# EAGLE design LP-LED (EAGLE 6.4)
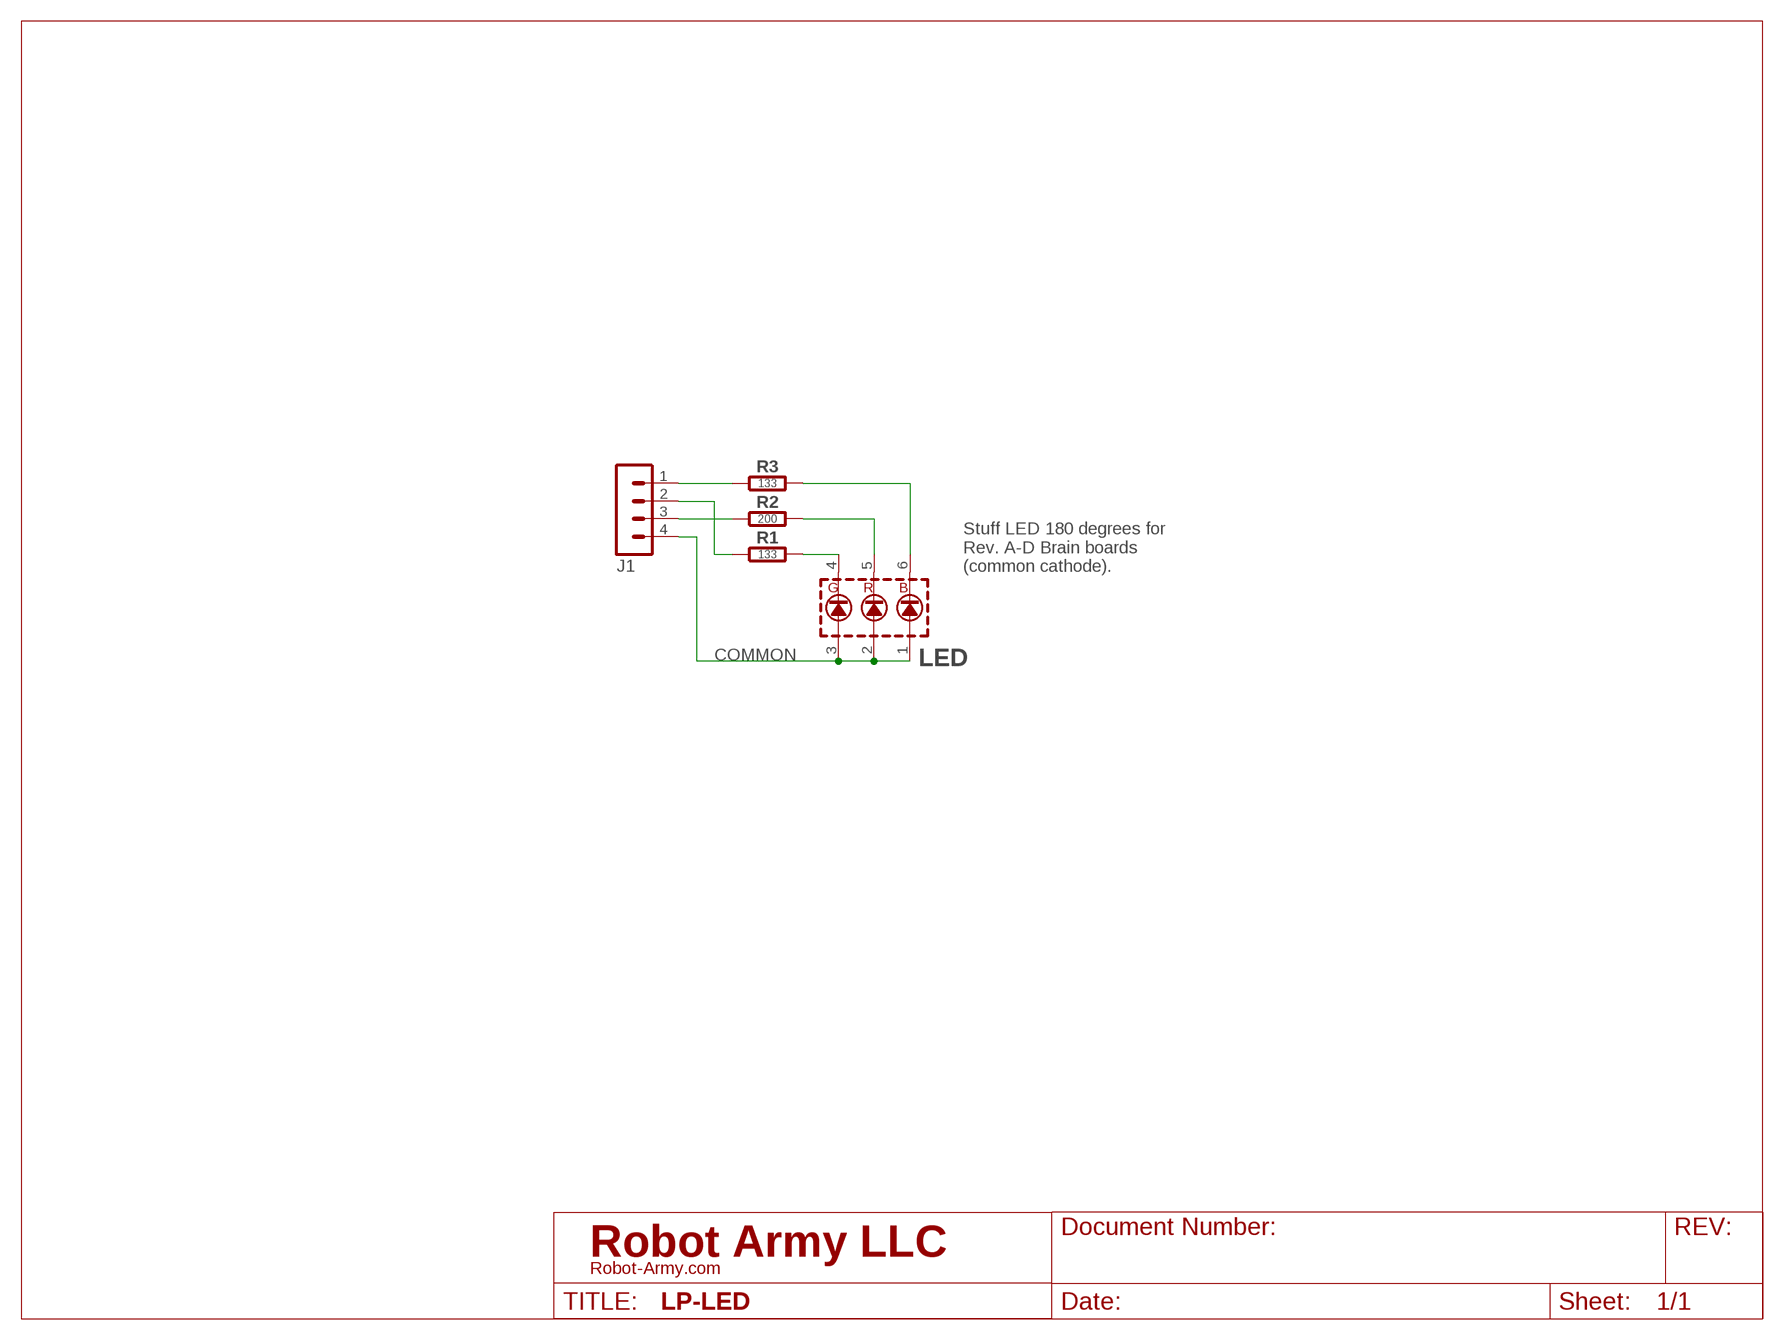
[diagram p0: schematic, sheet 1]

## Parts
J1  MA04-1  [MA04-1]
LED  RGB_INDIVPLCC-6  [PLCC-6]
R1  133  RESISTOR0805  [0805]
R2  200  RESISTOR0805  [0805]
R3  133  RESISTOR0805  [0805]

## Nets
COMMON: J1.4 LED.1(AB) LED.2(AR) LED.3(AG)
N$1: LED.4(KG) R1.2
N$2: J1.3 R2.1
N$3: LED.6(KB) R3.2
N$4: LED.5(KR) R2.2
N$5: J1.2 R1.1
N$6: J1.1 R3.1

## Notes on the sheet
- Stuff LED 180 degrees for 
  Rev. A-D Brain boards 
  (common cathode).

## Library data of the parts
J1 = con-headers:MA04-1: PIN HEADER
LED = led:RGB_INDIV: RGB LED - SIngle Package - Individual LEDs
R1-R3 = rlc:RESISTOR: Resistor

## Board
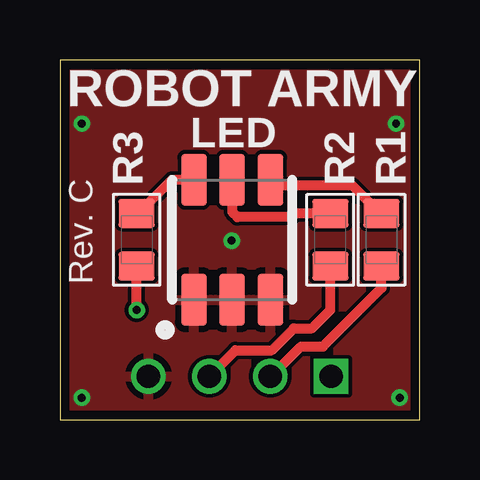
[diagram p1: board, top side]
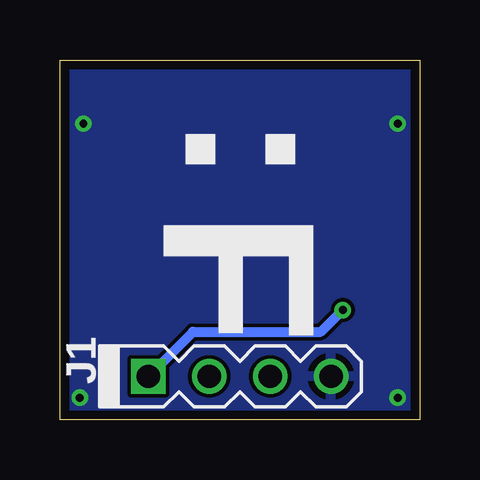
[diagram p2: board, bottom side, seen from below]

Size 15 x 15 mm. Coordinates in mm from the lower left corner, seen from the top.
Outline: 0,0 15,0 15,15 0,15 0,0
Copper layers (1*16): Top 0.0356mm / dielectric 1.5011mm / Bottom 0.0356mm
Design rules "OSH-CircuitMonkey": minimum track width 6mil, minimum drill 13mil, track to track 6mil, track to pad 6mil, pad to pad 6mil, via to via 6mil, smd to smd 6mil, copper to edge 15mil, drill to drill 6mil, minimum pad ring 7mil, minimum via ring 7mil, stop-mask expansion 3mil, vias tented up to drill 13mil, thermal gap 10mil

### Footprints (pad centres in the part's own frame; a part is rotated, then mirrored left to right if it is on the bottom)
MA04-1 = drill 0.965 square: 1 -3.81,0 | drill 0.965: 2 -1.27,0; 3 1.27,0; 4 3.81,0
PLCC-6 = smd 2.184 x 1.067: 1 -2.5,1.6; 2 -2.5,0; 3 -2.5,-1.6; 4 2.5,-1.6; 5 2.5,0; 6 2.5,1.6
0805 = smd 1.2 x 1.5: 1 -1.1,0; 2 1.1,0

### Placement (x,y rotation side)
J1  7.5,1.8 0 bottom
LED  7.19,7.5 90 top
R1  13.41,7.5 90 top
R2  11.28,7.5 90 top
R3  3.2,7.5 90 top

### Tracks (layer width: path | path; a pad name or v marks a point on that pad's centre or on a via)
COMMON  (via drill 0.33)
  other vias: 0.91,12.34 14.02,12.34 0.91,0.91 14.17,0.91 7.16,7.47
  pour Bottom: 0,15 15,15 15,0 0,0
  pour Top: 0,15 15,15 15,0 0,0
N$1
  Top 0.406: R1.2 13.19,8.45 13.19,8.75 12.19,9.75 9.03,9.75 LED.4
N$2
  Top 0.406: J1.3 7.32,2.9 8.84,2.9 9.75,3.81 10.52,3.81 11.28,4.57 R2.1
N$3
  Top 0.406: R3.2 3.27,8.6 4.67,10 LED.6
N$4
  Top 0.406: LED.5 7.18,8.66 7.4,8.45 9.67,8.45 9.75,8.53 9.82,8.6 R2.2
N$5
  Top 0.406: J1.2 8.81,1.8 10.06,3.05 10.97,3.05 13.41,5.49 R1.1
N$6  (via drill 0.33)
  Top 0.406: v3.2,4.57 R3.1
  Bottom 0.406: J1.1 9.45,3.66 4.12,3.66 v3.2,4.57

### Text on the board
tPlace: ROBOT ARMY | Rev. C
bPlace: : | F